# Altium schematic sheet 基于STM32的DDS信号源的设计实例.SchDoc
size A3
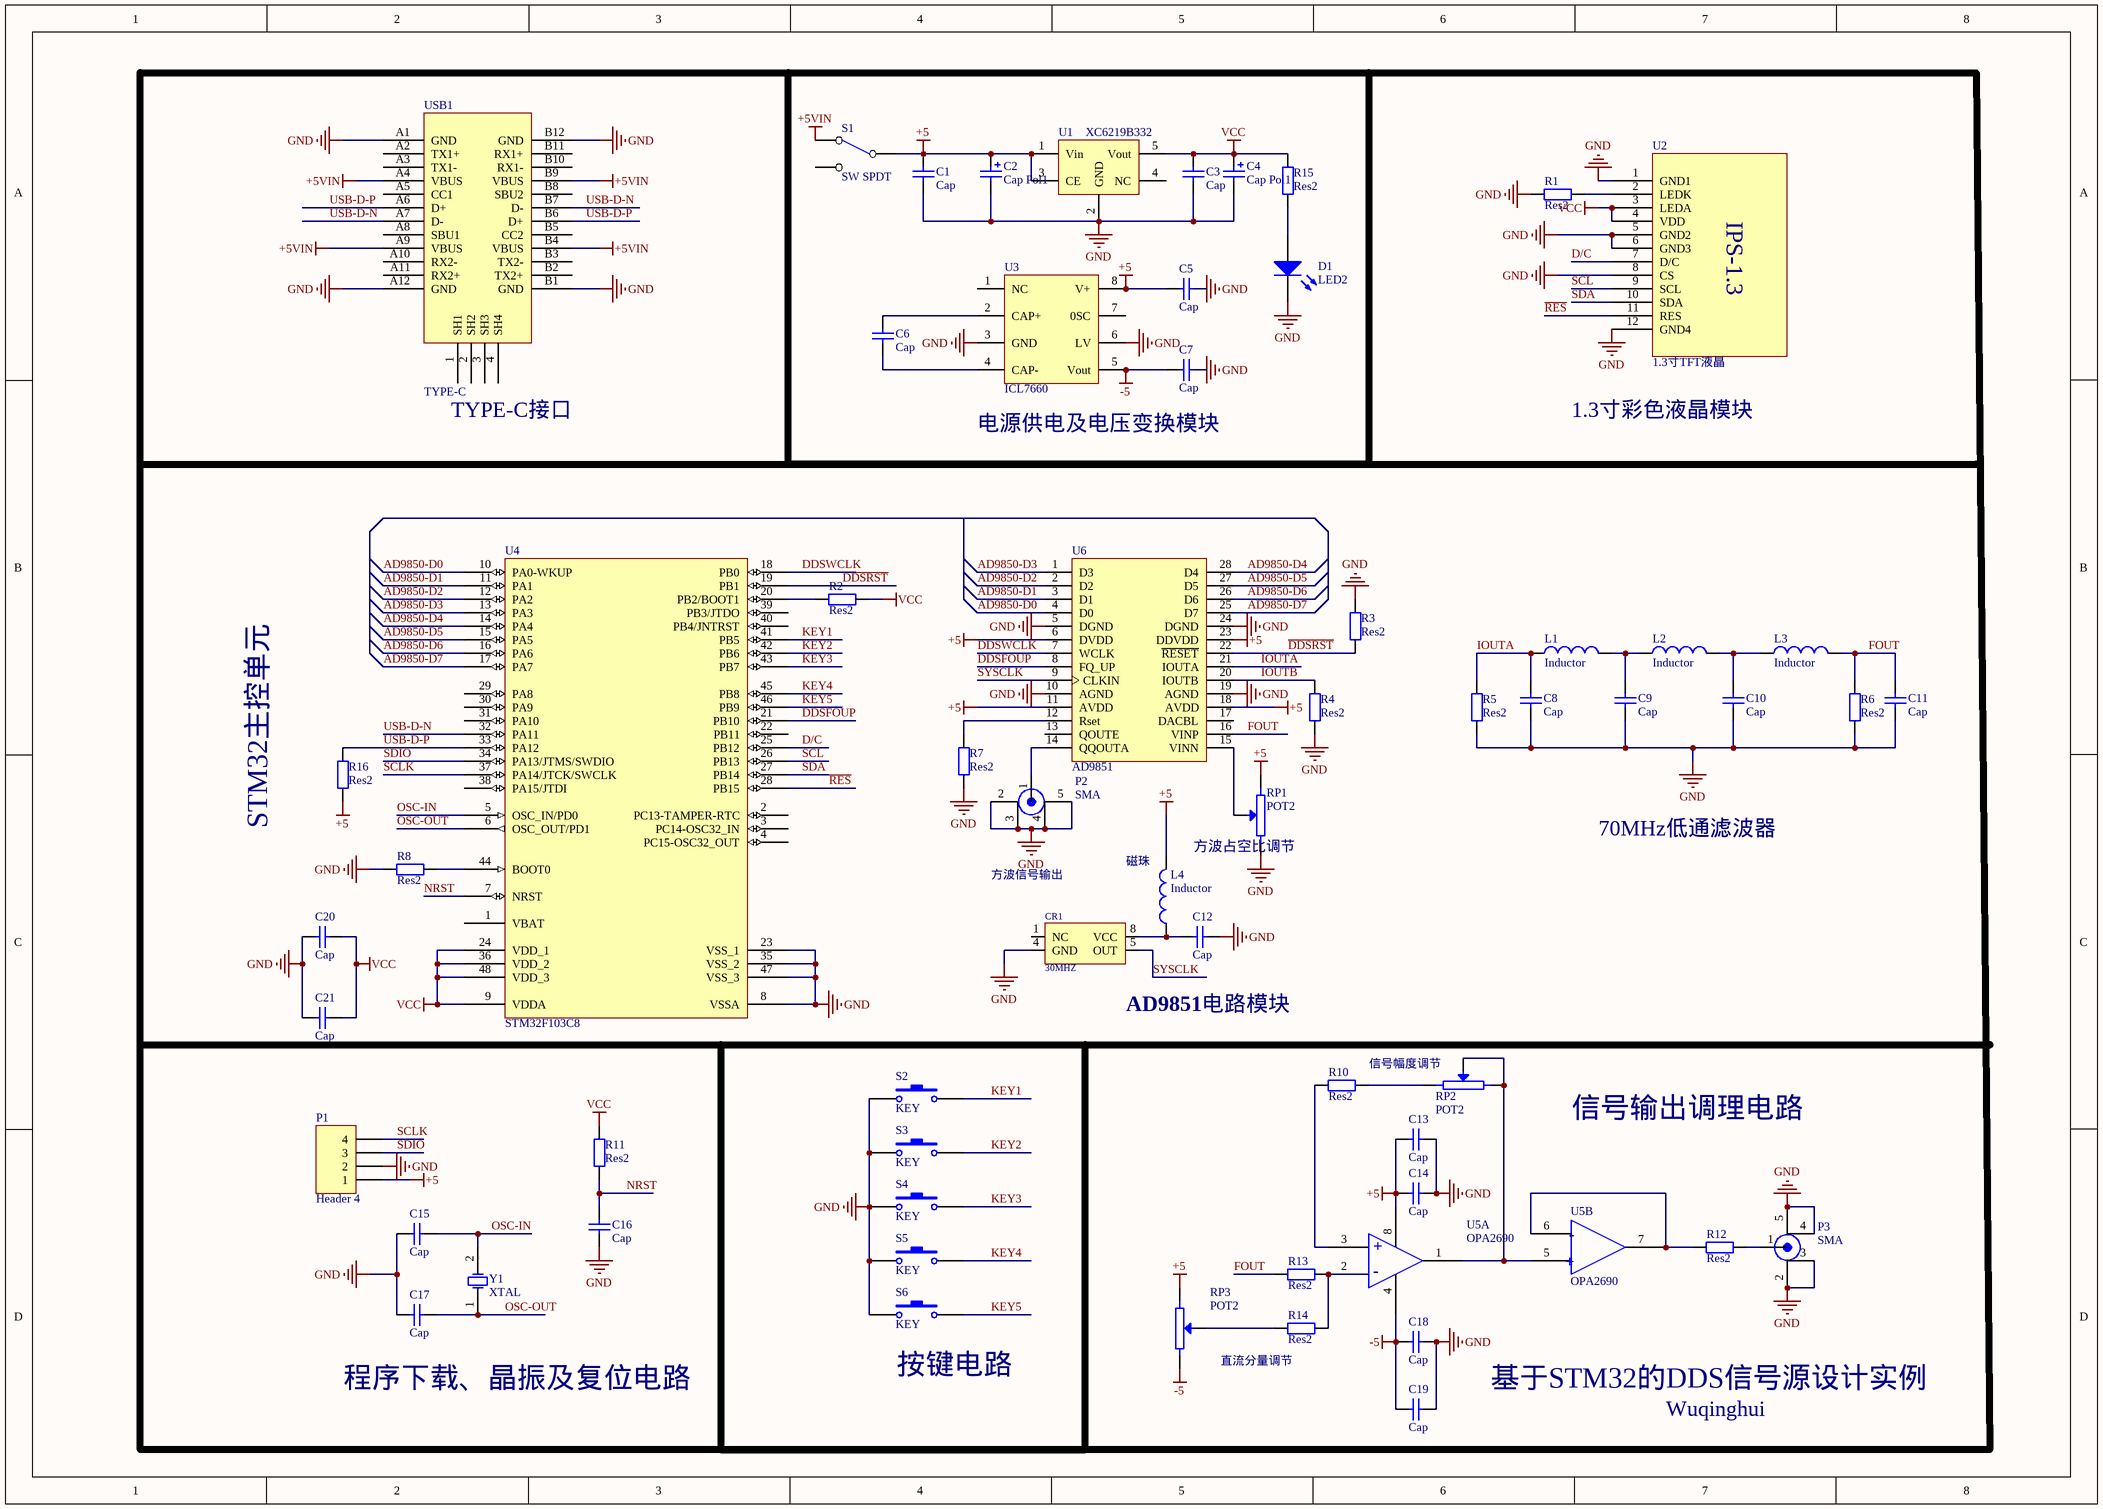
[diagram p0: 基于STM32的DDS信号源的设计实例.SchDoc]

## Parts
C1  Cap  [C0805]
C2  Cap Pol1  [C1210_N]
C3  Cap  [C0805]
C4  Cap Pol1  [C1210_N]
C5  Cap  [C0805]
C6  Cap  [C0805]
C7  Cap  [C0805]
C8  Cap  [C0805]
C9  Cap  [C0805]
C10  Cap  [C0805]
C11  Cap  [C0805]
C12  Cap  [C0805]
C13  Cap  [C0805]
C14  Cap  [C0805]
C15  Cap  [C0805]
C16  Cap  [C0805]
C17  Cap  [C0805]
C18  Cap  [C0805]
C19  Cap  [C0805]
C20  Cap  [C0805]
C21  Cap  [C0805]
CR1  30MHZ  [CRYSTAL-SMT-5X7]
D1  LED2  [D0805+]
L1  Inductor  [6-0805_N]
L2  Inductor  [6-0805_N]
L3  Inductor  [6-0805_N]
L4  Inductor  [6-0805_N]
P1  Header 4  [HDR1X4]
P2  SMA  [SMA-KE]
P3  SMA  [SMA-KE]
R1  Res2  [6-0805_N]
R2  Res2  [6-0805_N]
R3  Res2  [6-0805_N]
R4  Res2  [6-0805_N]
R5  Res2  [6-0805_N]
R6  Res2  [6-0805_N]
R7  Res2  [6-0805_N]
R8  Res2  [6-0805_N]
R10  Res2  [6-0805_N]
R11  Res2  [6-0805_N]
R12  Res2  [6-0805_N]
R13  Res2  [6-0805_N]
R14  Res2  [6-0805_N]
R15  Res2  [6-0805_N]
R16  Res2  [6-0805_N]
RP1  POT2  [VR7]
RP2  POT2  [VR7]
RP3  POT2  [VR7]
S1  SW SPDT  [SW]
S2  KEY  [SW-MINI]
S3  KEY  [SW-MINI]
S4  KEY  [SW-MINI]
S5  KEY  [SW-MINI]
S6  KEY  [SW-MINI]
U1  XC6219B332  [SOT23-5L]
U2  1.3寸TFT液晶  [1.3-TFT-TPS]
U3  ICL7660  [SO8_N]
U4  STM32F103C8  [TQFP-48]
U5  OPA2690  [SO-8]  (parts A,B of 2)
U6  AD9851  [TSSOP28]
USB1  TYPE-C  [TYPE-C]
Y1  XTAL  [XTAL2]

## Nets
+5: C1.2 C2.1 C5.1 C13.1 C14.1 L4.2 P1.1 R16.1 RP1.2 RP3.1 S1.2(COMMON) U1.1(Vin) U1.3(CE) U3.8(V+) U5.8 U6.6(DVDD) U6.11(AVDD) U6.18(AVDD) U6.23(DDVDD)
+5VIN: S1.1(NC) USB1.A4(VBUS) USB1.A9(VBUS) USB1.B4(VBUS) USB1.B9(VBUS)
-5: C7.1 C18.1 C19.1 RP3.2 U3.5(Vout) U5.4
GND: C1.1 C2.2 C3.1 C4.2 C5.2 C7.2 C8.1 C9.1 C10.1 C11.1 C12.2 C13.2 C14.2 C15.1 C16.1 C17.1 C18.2 C19.2 C20.1 C21.1 CR1.4(GND) D1.K P1.2 P2.2 P2.3 P2.4 P2.5 P3.2 P3.3 P3.4 P3.5 R1.1 R3.2 R4.1 R5.1 R6.1 R7.1 R8.2 RP1.1 S2.1 S3.1 S4.1 S5.1 S6.1 U1.2(GND) U2.1(GND1) U2.5(GND2) U2.6(GND3) U2.8(CS) U2.12(GND4) U3.3(GND) U3.6(LV) U4.8(VSSA) U4.23(VSS_1) U4.35(VSS_2) U4.47(VSS_3) U6.5(DGND) U6.10(AGND) U6.19(AGND) U6.24(DGND) USB1.A1(GND) USB1.A12(GND) USB1.B1(GND) USB1.B12(GND)
VCC: C3.2 C4.1 C20.2 C21.2 R2.2 R11.2 R15.2 U1.5(Vout) U2.3(LEDA) U2.4(VDD) U4.9(VDDA) U4.24(VDD_1) U4.36(VDD_2) U4.48(VDD_3)
AD9850-D0: U4.10(PA0-WKUP) U6.4(D0)
AD9850-D1: U4.11(PA1) U6.3(D1)
AD9850-D2: U4.12(PA2) U6.2(D2)
AD9850-D3: U4.13(PA3) U6.1(D3)
AD9850-D4: U4.14(PA4) U6.28(D4)
AD9850-D5: U4.15(PA5) U6.27(D5)
AD9850-D6: U4.16(PA6) U6.26(D6)
AD9850-D7: U4.17(PA7) U6.25(D7)
D/C: U2.7(D/C) U4.25(PB12)
~{DDSRST}: R3.1 U4.19(PB1) U6.22(~{RESET})
DDSFOUP: U4.21(PB10) U6.8(FQ_UP)
DDSWCLK: U4.18(PB0) U6.7(WCLK)
FOUT: C11.2 L3.2 R6.2 R13.1 U6.16(VINP)
IOUTA: C8.2 L1.1 R5.2 U6.21(IOUTA)
IOUTB: R4.2 U6.20(IOUTB)
KEY1: S2.2 U4.41(PB5)
KEY2: S3.2 U4.42(PB6)
KEY3: S4.2 U4.43(PB7)
KEY4: S5.2 U4.45(PB8)
KEY5: S6.2 U4.46(PB9)
NRST: C16.2 R11.1 U4.7(NRST)
OSC-IN: C15.2 U4.5(OSC_IN/PD0) Y1.2(OSC2)
OSC-OUT: C17.2 U4.6(OSC_OUT/PD1) Y1.1(OSC1)
~{RES}: U2.11(RES) U4.28(PB15)
SCL: U2.9(SCL) U4.26(PB13)
SCLK: P1.4 U4.37(PA14/JTCK/SWCLK)
SDA: U2.10(SDA) U4.27(PB14)
SDIO: P1.3 U4.34(PA13/JTMS/SWDIO)
SYSCLK: CR1.5(OUT) U6.9(CLKIN)
USB-D-N: U4.32(PA11) USB1.A7(D-) USB1.B7(D-)
USB-D-P: R16.2 U4.33(PA12) USB1.A6(D+) USB1.B6(D+)
NetC6_1: C6.1 U3.4(CAP-)
NetC6_2: C6.2 U3.2(CAP+)
NetC9_2: C9.2 L1.2 L2.1
NetC10_2: C10.2 L2.2 L3.1
NetC12_1: C12.1 CR1.8(VCC) L4.1
NetD1_A: D1.A R15.1
NetP2_1: P2.1 U6.14(QQOUTA)
NetP3_1: P3.1 R12.2
NetR1_2: R1.2 U2.2(LEDK)
NetR2_1: R2.1 U4.20(PB2/BOOT1)
NetR7_2: R7.2 U6.12(Rset)
NetR8_1: R8.1 U4.44(BOOT0)
NetR10_2: R10.2 RP2.1
NetR12_1: R12.1 U5.7
NetR13_2: R13.2 R14.2 U5.2
NetR14_1: R14.1 RP3.3
NetRP1_3: RP1.3 U6.15(VINN)
NetRP2_2: RP2.2 RP2.3 U5.1

Not connected (* = marked no-connect by the designer): CR1 1(NC); R10 1; S1 3(NO); U1 4(NC); U3 1(NC) 7(0SC); U4 1(VBAT) 2(PC13-TAMPER-RTC) 3(PC14-OSC32_IN) 4(PC15-OSC32_OUT) 22(PB11) 29(PA8) 30(PA9) 31(PA10) 38(PA15/JTDI) 39(PB3/JTDO) 40(PB4/JNTRST); U5 3 5 6; U6 13(QOUTE) 17(DACBL); USB1 1(SH1) 2(SH2) 3(SH3) 4(SH4) A2(TX1+) A3(TX1-) A5(CC1) A8(SBU1) A10(RX2-) A11(RX2+) B2(TX2+) B3(TX2-) B5(CC2) B8(SBU2) B10(RX1-) B11(RX1+)

## Notes on the sheet
- TYPE-C接口
- (near U3) 电源供电及电压变换模块
- 1.3寸彩色液晶模块
- STM32主控单元
- (near RP1) 方波占空比调节
- 70MHz低通滤波器
- 方波信号输出
- (near L4) 磁珠
- AD9851电路模块
- 信号幅度调节
- 信号输出调理电路
- 程序下载、晶振及复位电路
- (near S6) 按键电路
- 直流分量调节
- 基于STM32的DDS信号源设计实例
- Wuqinghui
- (in symbol 1.3寸TFT液晶) IPS-1.3
- (in symbol OPA2690, part A) +; -
- (in symbol OPA2690, part B) -; +

## Library data of the parts
C1 C3 C5-C21 = Cap: Capacitor; Published: 8-Jun-2000; LatestRevisionDate: 17-Jul-2002; LatestRevisionNote: Re-released for DXP Platform.; PackageReference: RAD-0.3; Publisher: Altium Limited; PackageDescription: Radial Cap, Thru-Hole; 2 Leads; 0.3 in Pin Spacing
C2 C4 = Cap Pol1: Polarized Capacitor (Radial); Published: 8-Jun-2000; LatestRevisionDate: 17-Jul-2002; LatestRevisionNote: Re-released for DXP Platform.; PackageReference: RB7.6-15; Publisher: Altium Limited; PackageDescription: Polarized Capacitor (Radial); 2 Leads
CR1 = CRYSTAL-DIP8
D1 = LED2: Typical RED, GREEN, YELLOW, AMBER GaAs LED; Published: 8-Jun-2000; LatestRevisionDate: 17-Jul-2002; LatestRevisionNote: Re-released for DXP Platform.; PackageVersion: Feb-2002; PackageReference: 3.2X1.6X1.1; Publisher: Altium Limited; PackageDescription: SM LED; 2 Flat Leads
L1-L4 = Inductor: Code_IEC: 1005; Published: 8-Jun-2000; LatestRevisionDate: 29-May-2009; LatestRevisionNote: IPC-7351 Footprint Added.; PackageReference: 0402-A; Publisher: Altium Limited; PackageDescription: Chip Inductor; Code_JEITA: 0402
P1 = Header 4: Header, 4-Pin; LatestRevisionDate: 17-Jul-2002; LatestRevisionNote: Re-released for DXP Platform.; Publisher: Altium Limited
R1-R8 R10-R16 = Res2: Resistor; Published: 8-Jun-2000; LatestRevisionDate: 17-Jul-2002; LatestRevisionNote: Re-released for DXP Platform.; PackageReference: AXIAL-0.4; Publisher: Altium Limited; PackageDescription: Axial Device, Thru-Hole; 2 Leads; 0.4 in Pin Spacing
RP1-RP3 = POT2: Potentiometer
S2-S6 = SW-PB: Switch; Published: 24-Mar-1999; LatestRevisionDate: 17-Jul-2002; LatestRevisionNote: Re-released for DXP Platform.; PackageReference: SPST-2; Publisher: Altium Limited; PackageDescription: Switch; 2 Leads
U1 = XC6219
U4 = STM32F103C8: Flaah:64/RAM:20/IO:36; BOM名称: 32位STM单片机; 版权归属: 源创客; 学习资源: www.ooocke.com
Y1 = XTAL: Crystal Oscillator; Published: 8-Jun-2000; LatestRevisionDate: 17-Jul-2002; LatestRevisionNote: Re-released for DXP Platform.; PackageReference: R38; Publisher: Altium Limited; PackageDescription: Crystal, Thru-Hole; 2 Leads; Body 3.1 x 8.2 mm (Dia.xH)